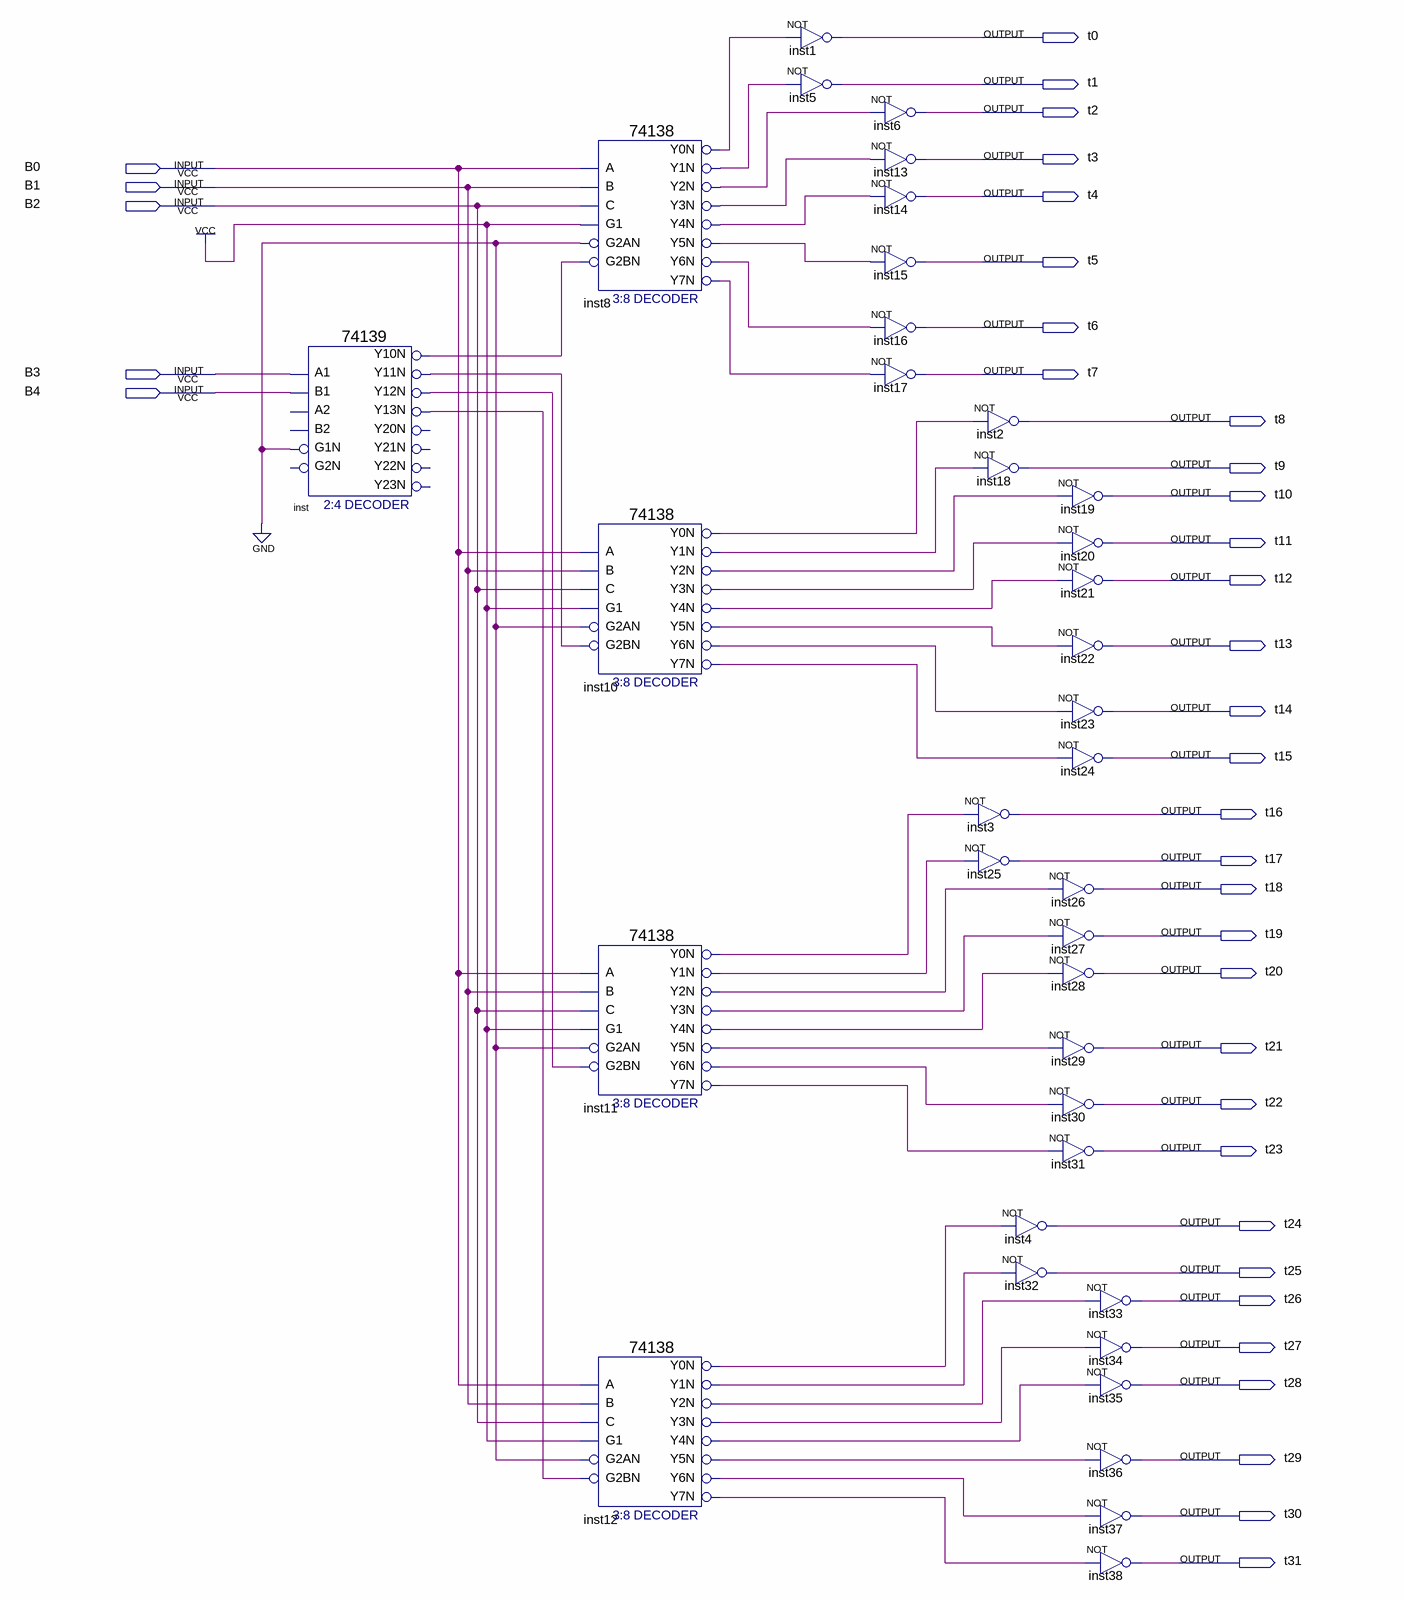
[diagram p0: schematic sheet]
// Quartus schematic logicPr2.bdf as structural Verilog: 37 symbols, 37 pins
module logicPr2 (
  input  B0,
  input  B1,
  input  B2,
  input  B3,
  input  B4,
  output t0,
  output t1,
  output t2,
  output t3,
  output t4,
  output t5,
  output t6,
  output t7,
  output t8,
  output t9,
  output t10,
  output t11,
  output t12,
  output t13,
  output t14,
  output t15,
  output t16,
  output t17,
  output t18,
  output t19,
  output t20,
  output t21,
  output t22,
  output t23,
  output t24,
  output t25,
  output t26,
  output t27,
  output t28,
  output t29,
  output t30,
  output t31
);

  wire inst8_y0n, inst8_y1n, inst8_y2n, inst8_y3n, inst8_y4n, inst8_y5n, inst8_y6n, inst8_y7n, inst10_y0n,
       inst10_y1n, inst10_y2n, inst10_y3n, inst10_y4n, inst10_y5n, inst10_y6n, inst10_y7n, inst11_y0n,
       inst11_y1n, inst11_y2n, inst11_y3n, inst11_y4n, inst11_y5n, inst11_y6n, inst11_y7n, inst12_y0n,
       inst12_y1n, inst12_y2n, inst12_y3n, inst12_y4n, inst12_y5n, inst12_y6n, inst12_y7n, inst_y10n,
       inst_y11n, inst_y12n, inst_y13n;

  \74139  inst (
    .A1(B3), .B1(B4), .G1N(1'b0), .Y10N(inst_y10n), .Y13N(inst_y13n), .Y12N(inst_y12n), .Y11N(inst_y11n));  // open: A2, B2, G2N, Y20N, Y21N, Y22N, Y23N
  \74138  inst8 (
    .A(B0), .B(B1), .G1(1'b1), .C(B2), .G2AN(1'b0), .G2BN(inst_y10n), .Y0N(inst8_y0n), .Y1N(inst8_y1n),
    .Y2N(inst8_y2n), .Y3N(inst8_y3n), .Y4N(inst8_y4n), .Y5N(inst8_y5n), .Y6N(inst8_y6n), .Y7N(inst8_y7n));
  \74138  inst10 (
    .A(B0), .B(B1), .G1(1'b1), .C(B2), .G2AN(1'b0), .G2BN(inst_y11n), .Y0N(inst10_y0n), .Y1N(inst10_y1n),
    .Y2N(inst10_y2n), .Y3N(inst10_y3n), .Y4N(inst10_y4n), .Y5N(inst10_y5n), .Y6N(inst10_y6n), .Y7N(inst10_y7n));
  \74138  inst11 (
    .A(B0), .B(B1), .G1(1'b1), .C(B2), .G2AN(1'b0), .G2BN(inst_y12n), .Y0N(inst11_y0n), .Y1N(inst11_y1n),
    .Y2N(inst11_y2n), .Y3N(inst11_y3n), .Y4N(inst11_y4n), .Y5N(inst11_y5n), .Y6N(inst11_y6n), .Y7N(inst11_y7n));
  \74138  inst12 (
    .A(B0), .B(B1), .G1(1'b1), .C(B2), .G2AN(1'b0), .G2BN(inst_y13n), .Y0N(inst12_y0n), .Y1N(inst12_y1n),
    .Y2N(inst12_y2n), .Y3N(inst12_y3n), .Y4N(inst12_y4n), .Y5N(inst12_y5n), .Y6N(inst12_y6n), .Y7N(inst12_y7n));
  not inst1 (t0, inst8_y0n);
  not inst5 (t1, inst8_y1n);
  not inst6 (t2, inst8_y2n);
  not inst13 (t3, inst8_y3n);
  not inst14 (t4, inst8_y4n);
  not inst15 (t5, inst8_y5n);
  not inst16 (t6, inst8_y6n);
  not inst17 (t7, inst8_y7n);
  not inst2 (t8, inst10_y0n);
  not inst18 (t9, inst10_y1n);
  not inst3 (t16, inst11_y0n);
  not inst25 (t17, inst11_y1n);
  not inst19 (t10, inst10_y2n);
  not inst20 (t11, inst10_y3n);
  not inst21 (t12, inst10_y4n);
  not inst22 (t13, inst10_y5n);
  not inst23 (t14, inst10_y6n);
  not inst24 (t15, inst10_y7n);
  not inst26 (t18, inst11_y2n);
  not inst27 (t19, inst11_y3n);
  not inst28 (t20, inst11_y4n);
  not inst29 (t21, inst11_y5n);
  not inst30 (t22, inst11_y6n);
  not inst31 (t23, inst11_y7n);
  not inst4 (t24, inst12_y0n);
  not inst32 (t25, inst12_y1n);
  not inst33 (t26, inst12_y2n);
  not inst34 (t27, inst12_y3n);
  not inst35 (t28, inst12_y4n);
  not inst36 (t29, inst12_y5n);
  not inst37 (t30, inst12_y6n);
  not inst38 (t31, inst12_y7n);
endmodule
